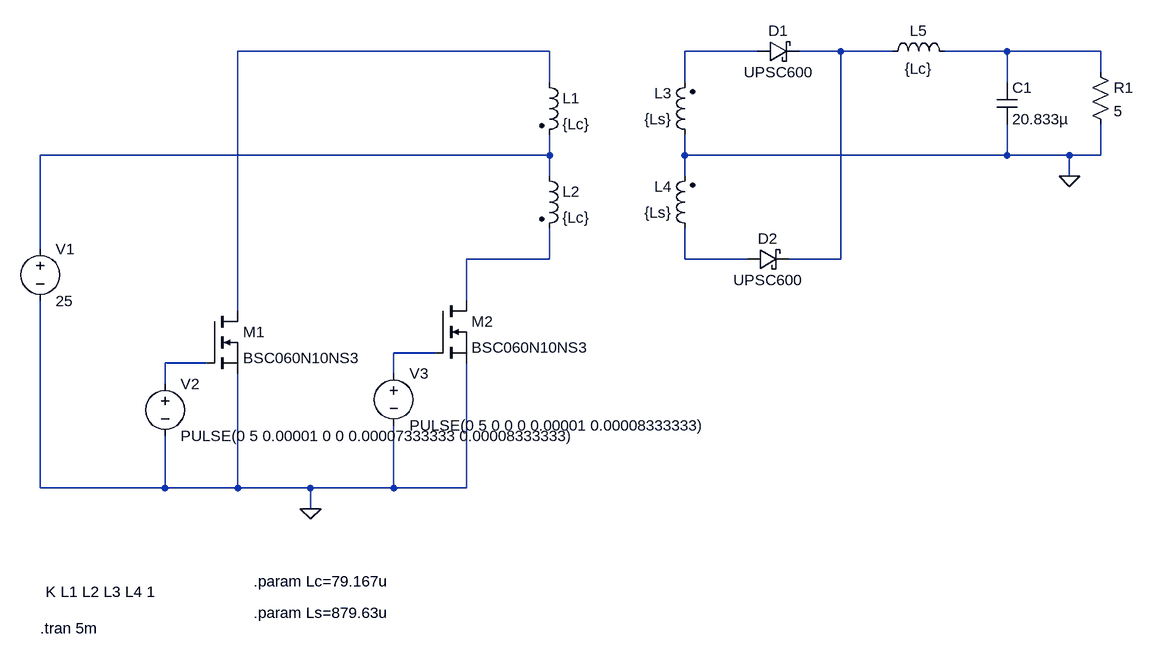
[diagram p0: schematic pushpull_circuit.asc]
pushpull_circuit.asc, the LTspice schematic file:
Version 4
SHEET 1 944 780
WIRE 32 -176 -448 -176
WIRE 352 -176 240 -176
WIRE 480 -176 416 -176
WIRE 560 -176 480 -176
WIRE 736 -176 640 -176
WIRE 880 -176 736 -176
WIRE 880 -144 880 -176
WIRE 32 -128 32 -176
WIRE 240 -128 240 -176
WIRE 736 -128 736 -176
WIRE 32 -16 32 -48
WIRE 32 -16 -752 -16
WIRE 240 -16 240 -48
WIRE 736 -16 736 -64
WIRE 736 -16 240 -16
WIRE 832 -16 736 -16
WIRE 880 -16 880 -64
WIRE 880 -16 832 -16
WIRE 32 16 32 -16
WIRE 240 16 240 -16
WIRE 832 16 832 -16
WIRE -752 128 -752 -16
WIRE 32 144 32 96
WIRE 32 144 -96 144
WIRE 240 144 240 96
WIRE 336 144 240 144
WIRE 480 144 480 -176
WIRE 480 144 400 144
WIRE -96 208 -96 144
WIRE -448 224 -448 -176
WIRE -144 288 -208 288
WIRE -496 304 -560 304
WIRE -208 320 -208 288
WIRE -560 336 -560 304
WIRE -752 496 -752 208
WIRE -560 496 -560 416
WIRE -560 496 -752 496
WIRE -448 496 -448 320
WIRE -448 496 -560 496
WIRE -336 496 -448 496
WIRE -208 496 -208 400
WIRE -208 496 -336 496
WIRE -96 496 -96 304
WIRE -96 496 -208 496
WIRE -336 528 -336 496
FLAG 832 16 0
FLAG -336 528 0
SYMBOL voltage -752 112 R0
WINDOW 123 0 0 Left 0
WINDOW 39 0 0 Left 0
SYMATTR InstName V1
SYMATTR Value 25
SYMBOL res 864 -160 R0
SYMATTR InstName R1
SYMATTR Value 5
SYMBOL voltage -208 304 R0
WINDOW 123 0 0 Left 0
WINDOW 39 0 0 Left 0
SYMATTR InstName V3
SYMATTR Value PULSE(0 5 0 0 0 0.00001 0.00008333333)
SYMBOL schottky 352 -160 R270
WINDOW 0 32 32 VTop 2
WINDOW 3 0 32 VBottom 2
SYMATTR InstName D1
SYMATTR Value UPSC600
SYMATTR Description Diode
SYMATTR Type diode
SYMBOL nmos -144 208 R0
SYMATTR InstName M2
SYMATTR Value BSC060N10NS3
SYMBOL ind2 16 -144 R0
SYMATTR InstName L1
SYMATTR Value {Lc}
SYMATTR Type ind
SYMBOL ind2 256 -32 R180
WINDOW 0 36 80 Left 2
WINDOW 3 36 40 Left 2
SYMATTR InstName L3
SYMATTR Value {Ls}
SYMATTR Type ind
SYMBOL cap 720 -128 R0
SYMATTR InstName C1
SYMATTR Value 20.833µ
SYMBOL schottky 336 160 R270
WINDOW 0 32 32 VTop 2
WINDOW 3 0 32 VBottom 2
SYMATTR InstName D2
SYMATTR Value UPSC600
SYMATTR Description Diode
SYMATTR Type diode
SYMBOL voltage -560 320 R0
WINDOW 123 0 0 Left 0
WINDOW 39 0 0 Left 0
SYMATTR InstName V2
SYMATTR Value PULSE(0 5 0.00001 0 0 0.00007333333 0.00008333333)
SYMBOL nmos -496 224 R0
SYMATTR InstName M1
SYMATTR Value BSC060N10NS3
SYMBOL ind2 16 0 R0
SYMATTR InstName L2
SYMATTR Value {Lc}
SYMATTR Type ind
SYMBOL ind2 256 112 R180
WINDOW 0 36 80 Left 2
WINDOW 3 36 40 Left 2
SYMATTR InstName L4
SYMATTR Value {Ls}
SYMATTR Type ind
SYMBOL ind 544 -160 R270
WINDOW 0 32 56 VTop 2
WINDOW 3 5 56 VBottom 2
SYMATTR InstName L5
SYMATTR Value {Lc}
TEXT -752 712 Left 2 !.tran 5m
TEXT -744 656 Left 2 !K L1 L2 L3 L4 1
TEXT -424 640 Left 2 !.param Lc=79.167u
TEXT -424 688 Left 2 !.param Ls=879.63u

The netlist it stands for:
* pushpull_circuit.asc
V1 N005 0 25
R1 N004 0 5
V3 N008 0 PULSE(0 5 0 0 0 0.00001 0.00008333333)
D1 N002 N003 UPSC600
M2 N006 N008 0 0 BSC060N10NS3
L1 N001 N005 {Lc}
L3 0 N002 {Ls}
C1 N004 0 20.833µ
D2 N007 N003 UPSC600
V2 N009 0 PULSE(0 5 0.00001 0 0 0.00007333333 0.00008333333)
M1 N001 N009 0 0 BSC060N10NS3
L2 N005 N006 {Lc}
L4 N007 0 {Ls}
L5 N003 N004 {Lc}
.model D D
.lib standard.dio
.model NMOS NMOS
.model PMOS PMOS
.lib standard.mos
.tran 5m
K L1 L2 L3 L4 1
.param Lc=79.167u
.param Ls=879.63u
.backanno
.end